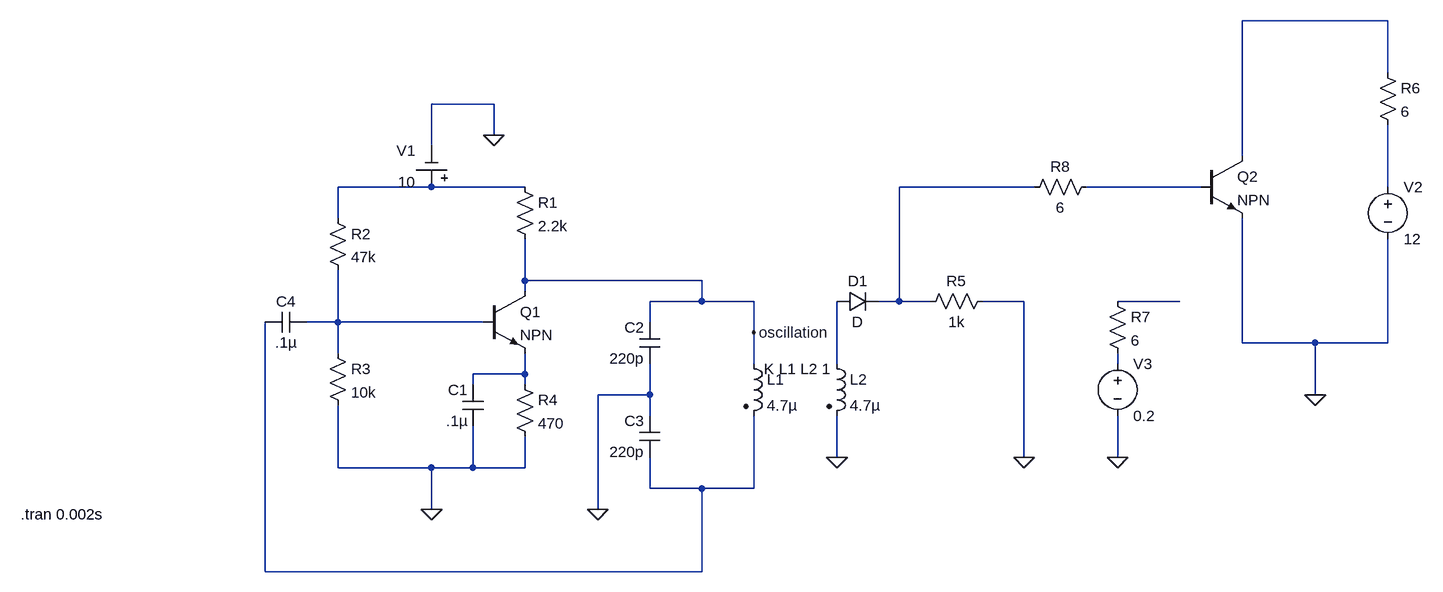
[diagram p0: schematic Transmitter & Receiver (Colpitts oscillators).asc]
Transmitter & Receiver (Colpitts oscillators).asc, the LTspice schematic file:
Version 4
SHEET 1 3024 680
WIRE 1568 -368 1344 -368
WIRE 1568 -288 1568 -368
WIRE 192 -240 96 -240
WIRE 192 -192 192 -240
WIRE 96 -176 96 -240
WIRE 1344 -160 1344 -368
WIRE 96 -112 -48 -112
WIRE 240 -112 96 -112
WIRE 1024 -112 816 -112
WIRE 1280 -112 1104 -112
WIRE 1568 -112 1568 -208
WIRE -48 -64 -48 -112
WIRE 240 32 240 -32
WIRE 512 32 240 32
WIRE 240 48 240 32
WIRE 512 64 512 32
WIRE 512 64 432 64
WIRE 592 64 512 64
WIRE 816 64 816 -112
WIRE 816 64 784 64
WIRE 864 64 816 64
WIRE 1008 64 944 64
WIRE 1248 64 1152 64
WIRE -48 96 -48 16
WIRE -48 96 -96 96
WIRE 176 96 -48 96
WIRE 432 96 432 64
WIRE 592 112 592 64
WIRE 1344 128 1344 -64
WIRE 1456 128 1344 128
WIRE 1568 128 1568 -32
WIRE 1568 128 1456 128
WIRE -48 144 -48 96
WIRE 592 160 592 112
WIRE 720 160 720 64
WIRE 1152 160 1152 144
WIRE 240 176 240 144
WIRE 240 176 160 176
WIRE 160 192 160 176
WIRE 240 192 240 176
WIRE 432 208 432 160
WIRE 432 208 352 208
WIRE 1456 208 1456 128
WIRE 432 240 432 208
WIRE 720 304 720 240
WIRE 1008 304 1008 64
WIRE 1152 304 1152 240
WIRE -48 320 -48 224
WIRE 96 320 -48 320
WIRE 160 320 160 256
WIRE 160 320 96 320
WIRE 240 320 240 272
WIRE 240 320 160 320
WIRE 432 352 432 304
WIRE 512 352 432 352
WIRE 592 352 592 240
WIRE 592 352 512 352
WIRE 96 384 96 320
WIRE 352 384 352 208
WIRE -160 480 -160 96
WIRE 512 480 512 352
WIRE 512 480 -160 480
FLAG 96 384 0
FLAG 352 384 0
FLAG 192 -192 0
FLAG 592 112 oscillation
FLAG 720 304 0
FLAG 1008 304 0
FLAG 1152 304 0
FLAG 1456 208 0
SYMBOL res 224 -128 R0
SYMATTR InstName R1
SYMATTR Value 2.2k
SYMBOL res -64 -80 R0
SYMATTR InstName R2
SYMATTR Value 47k
SYMBOL res 224 176 R0
SYMATTR InstName R4
SYMATTR Value 470
SYMBOL res -64 128 R0
SYMATTR InstName R3
SYMATTR Value 10k
SYMBOL cap 176 256 R180
WINDOW 0 24 56 Left 2
WINDOW 3 24 8 Left 2
SYMATTR InstName C1
SYMATTR Value .1µ
SYMBOL cap 448 160 R180
WINDOW 0 24 56 Left 2
WINDOW 3 24 8 Left 2
SYMATTR InstName C2
SYMATTR Value 220p
SYMBOL cap 448 304 R180
WINDOW 0 24 56 Left 2
WINDOW 3 24 8 Left 2
SYMATTR InstName C3
SYMATTR Value 220p
SYMBOL ind2 576 144 R0
SYMATTR InstName L1
SYMATTR Value 4.7µ
SYMATTR Type ind
SYMBOL cap -96 80 R90
WINDOW 0 0 32 VBottom 2
WINDOW 3 32 32 VTop 2
SYMATTR InstName C4
SYMATTR Value .1µ
SYMBOL Misc\\cell 96 -112 R180
WINDOW 0 24 56 Left 2
WINDOW 3 24 8 Left 2
WINDOW 123 0 0 Left 0
WINDOW 39 0 0 Left 0
SYMATTR InstName V1
SYMATTR Value 10
SYMBOL npn 176 48 R0
SYMATTR InstName Q1
SYMBOL ind2 704 144 R0
SYMATTR InstName L2
SYMATTR Value 4.7µ
SYMATTR Type ind
SYMBOL diode 720 80 R270
WINDOW 0 32 32 VTop 2
WINDOW 3 0 32 VBottom 2
SYMATTR InstName D1
SYMBOL res 848 80 R270
WINDOW 0 32 56 VTop 2
WINDOW 3 0 56 VBottom 2
SYMATTR InstName R5
SYMATTR Value 1k
SYMBOL npn 1280 -160 R0
SYMATTR InstName Q2
SYMBOL voltage 1568 -128 R0
WINDOW 123 0 0 Left 0
WINDOW 39 0 0 Left 0
SYMATTR InstName V2
SYMATTR Value 12
SYMBOL res 1552 -304 R0
SYMATTR InstName R6
SYMATTR Value 6
SYMBOL voltage 1152 144 R0
WINDOW 123 0 0 Left 0
WINDOW 39 0 0 Left 0
SYMATTR InstName V3
SYMATTR Value 0.2
SYMBOL res 1136 48 R0
SYMATTR InstName R7
SYMATTR Value 6
SYMBOL res 1120 -128 R90
WINDOW 0 0 56 VBottom 2
WINDOW 3 32 56 VTop 2
SYMATTR InstName R8
SYMATTR Value 6
TEXT -536 392 Left 2 !.tran 0.002s
TEXT 608 168 Left 2 !K L1 L2 1

The netlist it stands for:
* Transmitter & Receiver (Colpitts oscillators).asc
R1 N002 oscillation 2.2k
R2 N002 N007 47k
R4 N010 0 470
R3 N007 0 10k
C1 0 N010 .1µ
C2 0 oscillation 220p
C3 N011 0 220p
L1 oscillation N011 4.7µ
C4 N007 N011 .1µ
V1 N002 0 10
Q1 oscillation N007 N010 0 NPN
L2 N008 0 4.7µ
D1 N008 N003 D
R5 N003 0 1k
Q2 N001 N004 0 0 NPN
V2 N005 0 12
R6 N001 N005 6
V3 N009 0 0.2
R7 N006 N009 6
R8 N004 N003 6
.model D D
.lib standard.dio
.model NPN NPN
.model PNP PNP
.lib standard.bjt
.tran 0.002s
K L1 L2 1
.backanno
.end